# Altium schematic sheet Remote_Control.SchDoc
size Letter
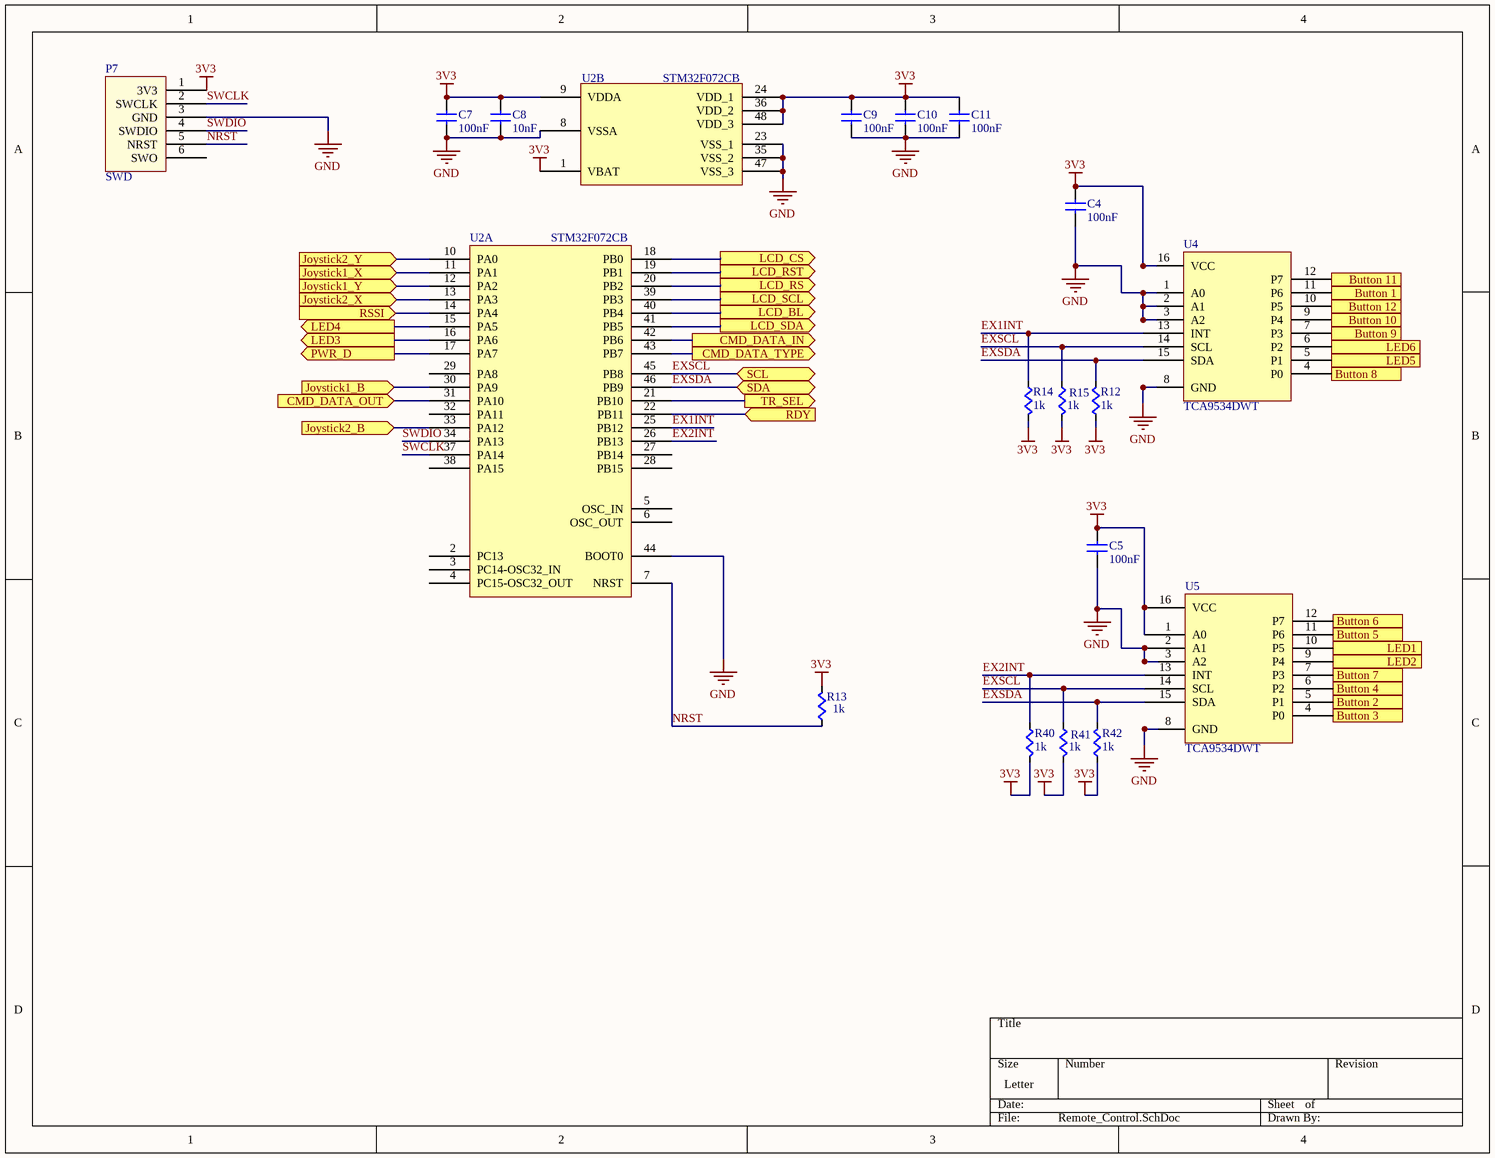
[diagram p0: Remote_Control.SchDoc]

## Parts
C4  value 100nF  [CAPC0603]  (hidden comment: Cap)
C5  value 100nF  [CAPC0603]  (hidden comment: Cap)
C7  value 100nF  [CAPC0603]  (hidden comment: Cap)
C8  value 10nF  [CAPC0603]  (hidden comment: Cap)
C9  value 100nF  [CAPC0603]  (hidden comment: Cap)
C10  value 100nF  [CAPC0603]  (hidden comment: Cap)
C11  value 100nF  [CAPC0603]  (hidden comment: Cap)
P7  SWD  [SWD_STM32]
R12  value 1k  [RES0603]  (hidden comment: Res)
R13  value 1k  [RES0603]  (hidden comment: Res)
R14  value 1k  [RES0603]  (hidden comment: Res)
R15  value 1k  [RES0603]  (hidden comment: Res)
R40  value 1k  [RES0603]  (hidden comment: Res)
R41  value 1k  [RES0603]  (hidden comment: Res)
R42  value 1k  [RES0603]  (hidden comment: Res)
U2  STM32F072CB  [STM32F072CB]  (parts A,B of 2)
U4  TCA9534DWT  [TCA9534DWT]
U5  TCA9534DWT  [TCA9534DWT]

## Ports
Button 1 (in), Button 2 (in), Button 3 (in), Button 4 (in), Button 5 (in), Button 6 (in), Button 7 (in), Button 8 (in), Button 9 (in), Button 10 (in), Button 11 (in), Button 12 (in), CMD_DATA_IN (out), CMD_DATA_OUT (in), CMD_DATA_TYPE (out), Joystick1_B (in), Joystick1_X (in), Joystick1_Y (in), Joystick2_B (in), Joystick2_X (in), Joystick2_Y (in), LCD_BL (out), LCD_CS (out), LCD_RS (out), LCD_RST (out), LCD_SCL (out), LCD_SDA (out), LED1 (out), LED2 (out), LED3 (out), LED4 (out), LED5 (out), LED6 (out), PWR_D (out), RDY (in), RSSI (in), SCL (bidir), SDA (bidir), TR_SEL (out)

## Nets
3V3: C4.1(A) C5.1(A) C7.1(A) C8.1(A) C9.1(A) C10.1(A) C11.1(A) P7.1(3V3) R12.2(B) R13.1(A) R14.1(A) R15.1(A) R40.1(A) R41.1(A) R42.2(B) U2.1(VBAT) U2.9(VDDA) U2.24(VDD_1) U2.36(VDD_2) U2.48(VDD_3) U4.16(VCC) U5.1(A0) U5.16(VCC)
GND: C4.2(B) C5.2(B) C7.2(B) C8.2(B) C9.2(B) C10.2(B) C11.2(B) P7.3(GND) U2.8(VSSA) U2.23(VSS_1) U2.35(VSS_2) U2.44(BOOT0) U2.47(VSS_3) U4.1(A0) U4.2(A1) U4.3(A2) U4.8(GND) U5.2(A1) U5.3(A2) U5.8(GND)
Button 1: U4.11(P6) ; port Button 1
Button 2: U5.5(P1) ; port Button 2
Button 3: U5.4(P0) ; port Button 3
Button 4: U5.6(P2) ; port Button 4
Button 5: U5.11(P6) ; port Button 5
Button 6: U5.12(P7) ; port Button 6
Button 7: U5.7(P3) ; port Button 7
Button 8: U4.4(P0) ; port Button 8
Button 9: U4.7(P3) ; port Button 9
Button 10: U4.9(P4) ; port Button 10
Button 11: U4.12(P7) ; port Button 11
Button 12: U4.10(P5) ; port Button 12
CMD_DATA_IN: U2.42(PB6) ; port CMD_DATA_IN
CMD_DATA_OUT: U2.31(PA10) ; port CMD_DATA_OUT
CMD_DATA_TYPE: U2.43(PB7) ; port CMD_DATA_TYPE
EX1INT: R14.2(B) U2.25(PB12) U4.13(INT)
EX2INT: R40.2(B) U2.26(PB13) U5.13(INT)
EXSCL: R15.2(B) R41.2(B) U2.45(PB8) U4.14(SCL) U5.14(SCL) ; port SCL
EXSDA: R12.1(A) R42.1(A) U2.46(PB9) U4.15(SDA) U5.15(SDA) ; port SDA
Joystick1_B: U2.30(PA9) ; port Joystick1_B
Joystick1_X: U2.11(PA1) ; port Joystick1_X
Joystick1_Y: U2.12(PA2) ; port Joystick1_Y
Joystick2_B: U2.33(PA12) ; port Joystick2_B
Joystick2_X: U2.13(PA3) ; port Joystick2_X
Joystick2_Y: U2.10(PA0) ; port Joystick2_Y
LCD_BL: U2.40(PB4) ; port LCD_BL
LCD_CS: U2.18(PB0) ; port LCD_CS
LCD_RS: U2.20(PB2) ; port LCD_RS
LCD_RST: U2.19(PB1) ; port LCD_RST
LCD_SCL: U2.39(PB3) ; port LCD_SCL
LCD_SDA: U2.41(PB5) ; port LCD_SDA
LED1: U5.10(P5) ; port LED1
LED2: U5.9(P4) ; port LED2
LED3: U2.16(PA6) ; port LED3
LED4: U2.15(PA5) ; port LED4
LED5: U4.5(P1) ; port LED5
LED6: U4.6(P2) ; port LED6
NRST: P7.5(NRST) R13.2(B) U2.7(NRST)
PWR_D: U2.17(PA7) ; port PWR_D
RDY: U2.22(PB11) ; port RDY
RSSI: U2.14(PA4) ; port RSSI
SWCLK: P7.2(SWCLK) U2.37(PA14)
SWDIO: P7.4(SWDIO) U2.34(PA13)
TR_SEL: U2.21(PB10) ; port TR_SEL

Not connected (* = marked no-connect by the designer): P7 6(SWO); U2 2(PC13) 3(PC14-OSC32_IN) 4(PC15-OSC32_OUT) 5(OSC_IN) 6(OSC_OUT) 27(PB14) 28(PB15) 29(PA8) 32(PA11) 38(PA15)

## Library data of the parts
P7 = SWD_STM32: SWD connector matching the pinout on STM Discovery Boards
U2 = STM32F072CB: MCU 32BIT 128KB FLASH 48LQFP; Supplier 1: Digi-Key; Supplier Part Number 1: 497-14645-ND
U4 U5 = TCA9534DWT: IC I/O EXPANDER I2C 8B 16-SOIC; Manufacturer 1: Texas Instruments; Supplier 1: Digi-Key; Supplier Part Number 1: 296-45201-1-ND; Manufacturer Part Number 1: TCA9534DWT; ComponentLink1URL: http://www.ti.com/lit/ds/symlink/tca9534.pdf; ComponentLink1Description: Datasheet; ComponentLink2URL: http://www.ti.com/product/TCA9534/technicaldocuments; ComponentLink2Description: Website
C4 C5 C7-C11 = Cap: Supplier 1: Digi-Key
  C4 C5 C7 C9-C11: Supplier Part Number 1: 1276-1000-1-ND
  C8: Supplier Part Number 1: 1276-6841-1-ND
R12-R15 R40-R42 = Res: Supplier 1: Digi-Key
  R12 R14 R15: Supplier Part Number 1: RMCF0603JT10K0CT-ND
  R13 R40-R42: Supplier Part Number 1: RMCF0603FG1K00CT-ND